# Altium schematic sheet 06_MCU.SchDoc: PSoC4
size A; Revision: A; SheetNumber: 6; SheetTotal: 10; ECE315_Project_Name: ECE315 F23 Wack-A-Mole
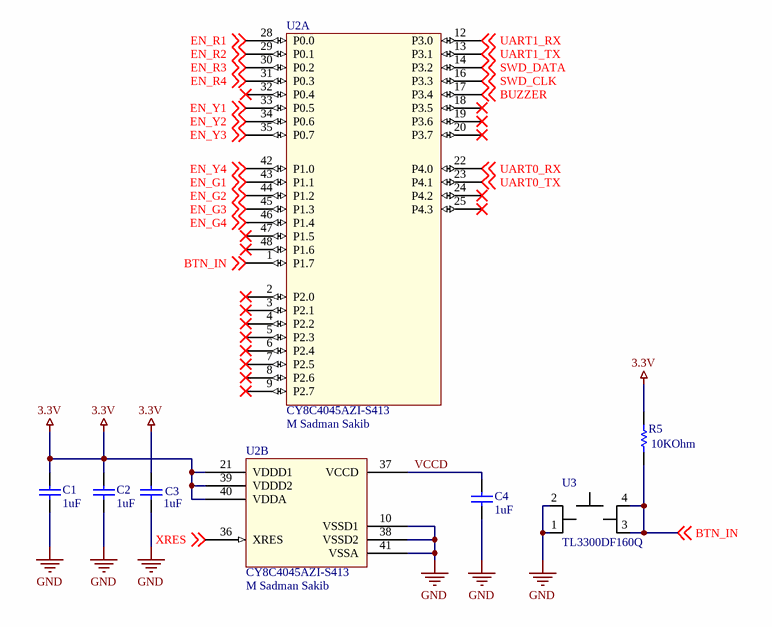
[diagram p0: 06_MCU.SchDoc]

## Parts
C1  Capacitance: 1uF  [CAPC3216X180X50ML20T25]  (hidden comment: C1206C105K3RACTU)
C2  Capacitance: 1uF  [CAPC3216X180X50ML20T25]  (hidden comment: C1206C105K3RACTU)
C3  Capacitance: 1uF  [CAPC3216X180X50ML20T25]  (hidden comment: C1206C105K3RACTU)
C4  Capacitance: 1uF  [CAPC3216X180X50ML20T25]  (hidden comment: C1206C105K3RACTU)
R5  Resistance: 10KOhm  [RESC3116X65X40ML10T20]  (hidden comment: RC1206FR-0710KL)
U2  CY8C4045AZI-S413  [TQFP48_7X7]  (parts A,B of 2)
U3  TL3300DF160Q  [TL3300DF160Q]

## Nets
3.3V: C1.2 C2.2 C3.2 R5.2 U2.21(VDDD1) U2.39(VDDD2) U2.40(VDDA)
GND: C1.1 C2.1 C3.1 C4.1 U2.10(VSSD1) U2.38(VSSD2) U2.41(VSSA) U3.1 U3.2
BTN_IN: R5.1 U2.1(P1.7) U3.3 U3.4(VCCIO) ; off-sheet BTN_IN
BUZZER: U2.17(P3.4) ; off-sheet BUZZER
EN_G1: U2.43(P1.1) ; off-sheet EN_G1
EN_G2: U2.44(P1.2) ; off-sheet EN_G2
EN_G3: U2.45(P1.3) ; off-sheet EN_G3
EN_G4: U2.46(P1.4) ; off-sheet EN_G4
EN_R1: U2.28(P0.0) ; off-sheet EN_R1
EN_R2: U2.29(P0.1) ; off-sheet EN_R2
EN_R3: U2.30(P0.2) ; off-sheet EN_R3
EN_R4: U2.31(P0.3) ; off-sheet EN_R4
EN_Y1: U2.33(P0.5) ; off-sheet EN_Y1
EN_Y2: U2.34(P0.6) ; off-sheet EN_Y2
EN_Y3: U2.35(P0.7) ; off-sheet EN_Y3
EN_Y4: U2.42(P1.0) ; off-sheet EN_Y4
SWD_CLK: U2.16(P3.3) ; off-sheet SWD_CLK
SWD_DATA: U2.14(P3.2) ; off-sheet SWD_DATA
UART0_RX: U2.22(P4.0) ; off-sheet UART0_RX
UART0_TX: U2.23(P4.1) ; off-sheet UART0_TX
UART1_RX: U2.12(P3.0) ; off-sheet UART1_RX
UART1_TX: U2.13(P3.1) ; off-sheet UART1_TX
VCCD: C4.2 U2.37(VCCD)
XRES: U2.36(XRES) ; off-sheet XRES

Not connected (* = marked no-connect by the designer): U2 2(P2.0)* 3(P2.1)* 4(P2.2)* 5(P2.3)* 6(P2.4)* 7(P2.5)* 8(P2.6)* 9(P2.7)* 18(P3.5)* 19(P3.6)* 20(P3.7)* 24(P4.2)* 25(P4.3)* 32(P0.4)* 47(P1.5)* 48(P1.6)*

## Notes on the sheet
- Title:
- Size:
- A
- Project
- Rev:
- Sheet:
- of
- College of Engineering
- 1415 Engineering Drive
- Madison, WI 53706

## Library data of the parts
C1-C4 = CMP-2000-04991-1: Chip Capacitor, 1 uF, +/- 10%, 25 V, -55 to 125 degC, 1206 (3216 Metric), RoHS, Tape and Reel; Manufacturer: Kemet; Temperature Coefficient / Code: +/-15%; Dielectric: X7R; Voltage Rating DC: 25V; Capacitance - nF: 1000nF; Class: Class1; Case Length: 3.2mm; Type: SMDMLCCX7R6.3-250VDCCommericalGrade; Case Width: 1.6mm; Product: GeneralTypeMLCCs; Datasheet URL: https://ciiva.com/datasheet-click-18194173?src=ciiva&sig=6daff8c4; Operating Temperature Range: -55Cto+125C; Series: C1206C; RoHS: Details; Product Category: MultilayerCeramicCapacitorsMLCC-SMD/SMT; Manufacturer URL: http://www.kemet.com/; Minimum Operating Temperature: -55C; Dimensions: 1.6mmWx3.2mmLx1.6mmH; Termination Style: SMD/SMT; Brand: Kemet; Packaging: Reel; Package / Case: 1206(3216metric); Case Code - mm: 3216; Datasheet Version: Jul-14; Factory Pack Quantity: 2000; Package Description: 2-Pin Surface Mount Device, Body 3.2 x 1.6 mm; Tolerance: 10%; Package Reference: 1206; Case Height: 1.6mm; Case Code - in: 1206; Maximum Operating Temperature: +125C; Voltage Rating: 25V
R5 = CMP-1014-00623-2: Chip Resistor, 10 KOhm, +/- 1%, 0.25 W, -55 to 155 degC, 1206 (3216 Metric), RoHS, Tape and Reel; Manufacturer: Yageo; Voltage Rating: 200V; Temperature Coefficient: 100ppm/degreesC; Power Rating: 250mW; Packaging: TapeandReel; Termination: SMD/SMT; REACH SVHC: Unknown; Tolerance: 1%; Height: 0.55mm; Composition: ThickFilm; Max Operating Temperature: 155degC; Datasheet Version: Rev. 5, 10/2016; Lead Free: LeadFree; Case Code (Metric): 3216; Depth: 1.6mm; Package Quantity: 5000; RoHSCompliant: true; Military Standard: Not; Case/Package: 1206; Case Code (Imperial): 1206; Min Operating Temperature: -55degC; Datasheet URL: http://www.yageo.com/NewPortal/yageodocoutput?fileName=/pdf/R-Chip/PYu-RC_Group_51_RoHS_L_5.pdf; Length: 3.1mm; Manufacturer URL: http://www.yageo.com/; Package Reference: 1206.0; Width: 1.6mm; Package Description: 2-Pin Surface Mount Device, Body 3.1 x 1.6 mm
U2 = CY8C4045AZI-S413: ARM Microcontrollers - MCU PSoC4; Manufacturer 1: Infineon; Supplier 1: Digi-Key; Supplier Part Number 1: 448-CY8C4045AZI-S413-ND; Manufacturer Part Number 1: CY8C4045AZI-S413; RoHS: Yes; Category: Uncategorized; Stock 1: 12044; Pricing 1: 1=3.87, 10=3.474, 25=3.284, 80=2.846, 250=2.70008, 500=2.42276, 1000=2.0433, 2500=1.946 (USD); RoHS Compliant: Yes; Parameter 1: *; M Sadman Sakib: M Sadman Sakib
U3 = TL3300DF160Q: Switch Tactile OFF (ON) SPST Round Button Gull Wing 0.05A 12VDC 1.57N SMD; Manufacturer: E-Switch; Contact Rating @ Voltage: 0.05A @ 12VDC; Outline: 12.00mm x 12.00mm; Circuit: SPST-NO; Switch Travel: 0.35mm; Actuator Type: Standard; Mechanical Life: 200,000 Cycles; Switch Function: Off-Mom; Actuator Height off PCB, from Pins: 4.30mm; Illumination: Non-Illuminated; Operating Force: 160gf; Actuator Orientation: Top Actuated; Current Rating: 50mA; Voltage Rating (DC): 12V; Illumination Voltage (Nominal): -; Mounting Type: Surface Mount; Illumination Type, Color: -; Packaging: Cut Tape (CT); Ingress Protection: -; RoHS: RoHS Compliant; Actuator Material: -; Category: Switches; Manufacturer Part Number: TL3300DF160Q; Operating Temperature: -25°C ~ 70°C; Features: -; Termination Style: Gull Wing; Supplier: Digi-Key; Supplier Part Number: EG4906CT-ND; Supplier 1: Digi-Key; Supplier Part Number 1: EG4906CT-ND; Manufacturer 1: E-Switch; Manufacturer Part Number 1: TL3300DF160Q; Stock 1: 57403; Pricing 1: 1=0.60000, 10=0.57800, 25=0.55680, 100=0.48180, 250=0.43896 (USD); Mount: Surface Mount; Case/Package: SMD/SMT; Contact Plating: Silver; Min Operating Temperature: -25°C; Max Operating Temperature: 70°C; Package Quantity: 1; Termination: Gull Wing; Illumination Type: Non-Illuminated; Throw Configuration: SPST; Series: TL3300; RoHS Compliant: Yes; ComponentLink1URL: https://datasheet.ciiva.com/2900/n301101-2900856.pdf?src-supplier=Digi-Key; ComponentLink1Description: https://datasheet.ciiva.com/2900/n301101-2900856.pdf?src-supplier=Digi-Key; ComponentLink2URL: https://datasheet.ciiva.com/2900/n301101-2900858.pdf?src-supplier=Digi-Key; ComponentLink2Description: https://datasheet.ciiva.com/2900/n301101-2900858.pdf?src-supplier=Digi-Key